# EAGLE design schema_breez (EAGLE 9.6.2)
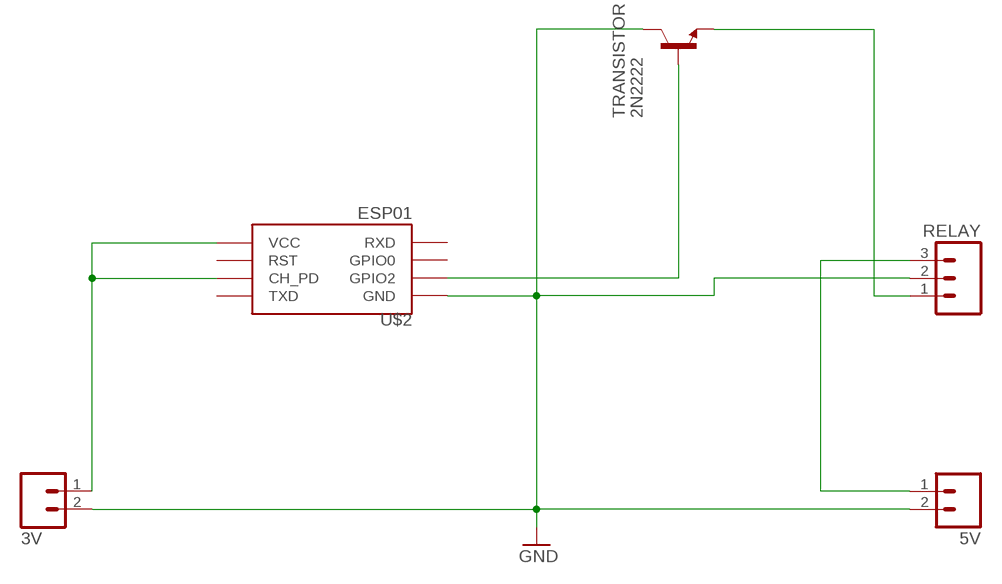
[diagram p0: schematic, sheet 1]

## Parts
3V  M02  [02P]
5V  M02  [02P]
RELAY  M03  [03P]
TRANSISTOR  2N2222  [TO18]
U$2  ESP01  [ESP01]

## Nets
GND: 3V.2 5V.2 RELAY.2 TRANSISTOR.3(C) U$2.GND
N$1: RELAY.1 TRANSISTOR.1(E)
N$2: TRANSISTOR.2(B) U$2.GPIO2
N$3: 5V.1 RELAY.3
N$4: 3V.1 U$2.CH_PD U$2.VCC
Unconnected: U$2.GPIO0 U$2.RST U$2.RX(RXD) U$2.TX(TXD)

## Library data of the parts
3V 5V = con-amp-quick:M02: AMP QUICK CONNECTOR; OC_FARNELL: unknown; OC_NEWARK: unknown
RELAY = con-amp-quick:M03: AMP QUICK CONNECTOR; OC_FARNELL: unknown; OC_NEWARK: unknown
TRANSISTOR = transistor:2N2222: NPN TRANSISTOR
U$2 = ESPBoards:ESP01: ESP8266 Wifi module 01

## Net classes
0 default: width 0.762 mm, drill 0.762 mm, clearance 0.762 mm

## Board
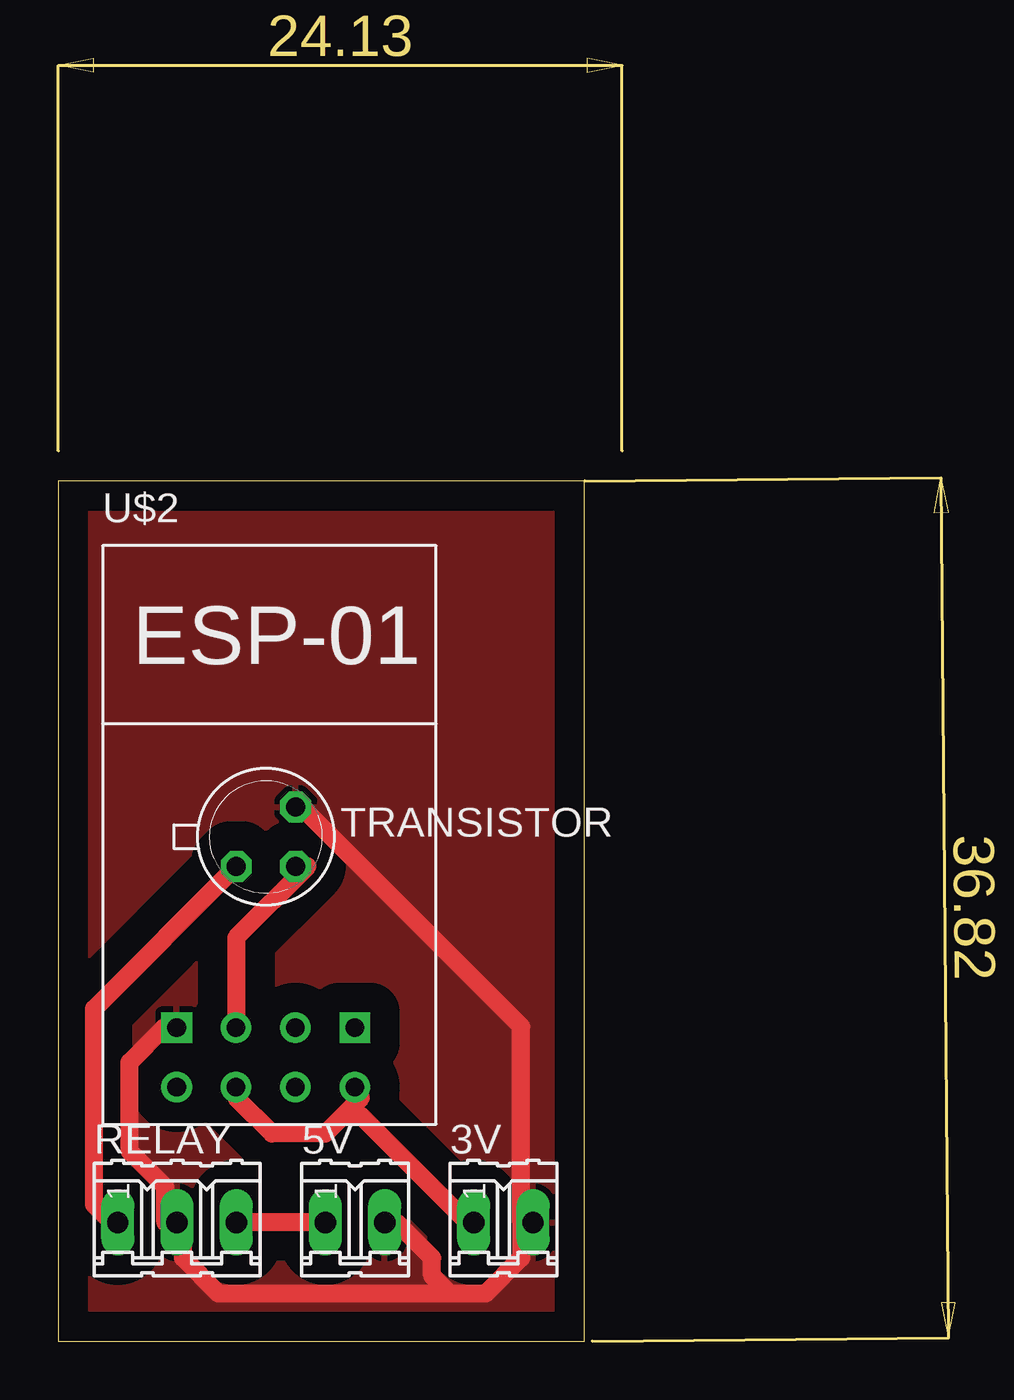
[diagram p1: board, top side]

Size 22.53 x 36.82 mm. Coordinates in mm from the lower left corner, seen from the top.
Outline: 0,0 22.53,0 22.53,36.82 0,36.82 0,0
Copper layers (1*16): Top 0.035mm / dielectric 1.5mm / Bottom 0.035mm
Design rules "default": minimum track width 6mil, minimum drill 0.35mm, track to track 6mil, track to pad 6mil, pad to pad 6mil, via to via 6mil, smd to smd 6mil, copper to edge 40mil, drill to drill 6mil, minimum pad ring 10mil, minimum via ring 8mil, stop-mask expansion 4mil, vias tented up to drill 0mil, thermal gap 10mil

### Footprints (pad centres in the part's own frame; a part is rotated, then mirrored left to right if it is on the bottom)
02P = drill 0.914 long: 1 -1.27,0; 2 1.27,0
03P = drill 0.914 long: 1 -2.54,0; 2 0,0; 3 2.54,0
TO18 = drill 0.813 octagon: 1 -1.27,-1.27; 2 1.27,-1.27; 3 1.27,1.27
ESP01 = drill 0.8: CH_PD -1.285,-8.178; GPIO0 1.255,-5.638; GPIO2 -1.285,-5.638; RST 1.255,-8.178; TX -3.825,-8.178; VCC 3.795,-8.178 | drill 0.8 square: GND -3.825,-5.638; RX 3.795,-5.638

### Placement (x,y rotation side)
3V  19.05,5.08 0 top
5V  12.7,5.08 0 top
RELAY  5.08,5.08 0 top
TRANSISTOR  8.89,21.59 0 top
U$2  8.89,19.05 0 top

### Tracks (layer width: path | path; a pad name or v marks a point on that pad's centre or on a via)
GND
  Top 0.762: U$2.GND 4.57,13.46 3.05,11.94 3.05,8.13 4.57,6.6 4.57,5.08 RELAY.2 5.33,5.08 5.33,3.56 6.86,2.03 16.76,2.03 | 19.81,5.08 19.81,13.46 10.67,22.61 TRANSISTOR.3 | 16.76,2.03 16,2.79 16,3.56 14.48,5.08 5V.2 | 16.76,2.03 18.29,2.03 19.81,3.56 19.81,5.08 | 19.81,5.08 3V.2
  pour Top (isolate 1.27): 0,36.83 22.86,36.83 22.86,0 0,0
N$1
  Top 0.762: TRANSISTOR.1 1.52,14.22 1.52,5.84 2.29,5.08 RELAY.1
N$2
  Top 0.762: U$2.GPIO2 7.62,13.46 7.62,17.27 10.67,20.32 TRANSISTOR.2
N$3
  Top 0.762: 5V.1 RELAY.3
N$4
  Top 0.762: 12.19,9.65 12.95,10.41 U$2.VCC | 12.19,9.65 11.43,8.89 9.14,8.89 7.62,10.41 U$2.CH_PD | 12.19,9.65 12.95,9.65 17.53,5.08 3V.1